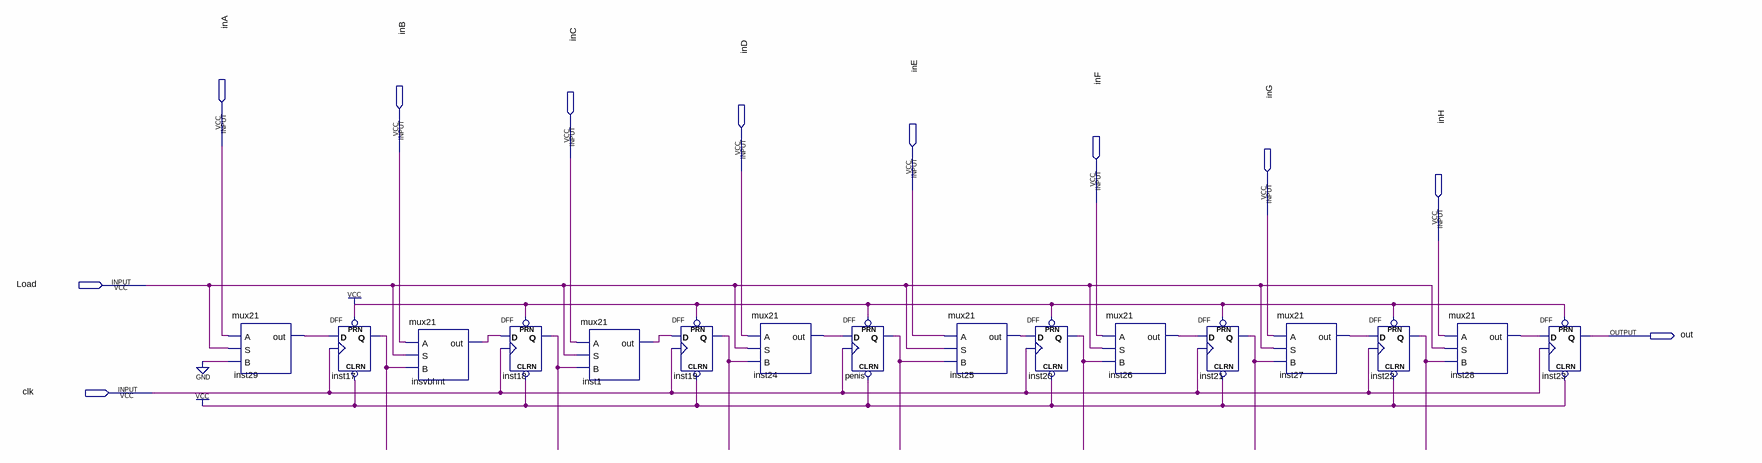
[diagram p0: schematic sheet]
// Quartus schematic PISO.bdf as structural Verilog: 16 symbols, 11 pins
module PISO (
  input  inA,
  input  inB,
  input  inC,
  input  inD,
  input  inE,
  input  inF,
  input  inG,
  input  inH,
  input  Load,
  input  clk,
  output out
);

  wire inst1_out, inst17_q, inst18_q, inst19_q, inst20_q, inst21_q, inst22_q, inst24_out, inst25_out,
       inst26_out, inst27_out, inst28_out, inst29_out, insvbhnt_out, penis_q;

  mux21 inst29 (.A(inA), .S(Load), .B(1'b0), .out(inst29_out));
  DFF inst17 (.CLRN(1'b1), .CLK(clk), .D(inst29_out), .PRN(1'b1), .Q(inst17_q));
  mux21 insvbhnt (.A(inB), .S(Load), .B(inst17_q), .out(insvbhnt_out));
  DFF inst18 (.CLRN(1'b1), .CLK(clk), .D(insvbhnt_out), .PRN(1'b1), .Q(inst18_q));
  mux21 inst1 (.A(inC), .S(Load), .B(inst18_q), .out(inst1_out));
  DFF inst19 (.CLRN(1'b1), .CLK(clk), .D(inst1_out), .PRN(1'b1), .Q(inst19_q));
  mux21 inst24 (.A(inD), .S(Load), .B(inst19_q), .out(inst24_out));
  DFF penis (.CLRN(1'b1), .CLK(clk), .D(inst24_out), .PRN(1'b1), .Q(penis_q));
  mux21 inst25 (.A(inE), .S(Load), .B(penis_q), .out(inst25_out));
  DFF inst20 (.CLRN(1'b1), .CLK(clk), .D(inst25_out), .PRN(1'b1), .Q(inst20_q));
  mux21 inst26 (.A(inF), .S(Load), .B(inst20_q), .out(inst26_out));
  DFF inst21 (.CLRN(1'b1), .CLK(clk), .D(inst26_out), .PRN(1'b1), .Q(inst21_q));
  mux21 inst27 (.A(inG), .S(Load), .B(inst21_q), .out(inst27_out));
  DFF inst22 (.CLRN(1'b1), .CLK(clk), .D(inst27_out), .PRN(1'b1), .Q(inst22_q));
  mux21 inst28 (.A(inH), .S(Load), .B(inst22_q), .out(inst28_out));
  DFF inst23 (.CLRN(1'b1), .CLK(clk), .D(inst28_out), .PRN(1'b1), .Q(out));
endmodule
